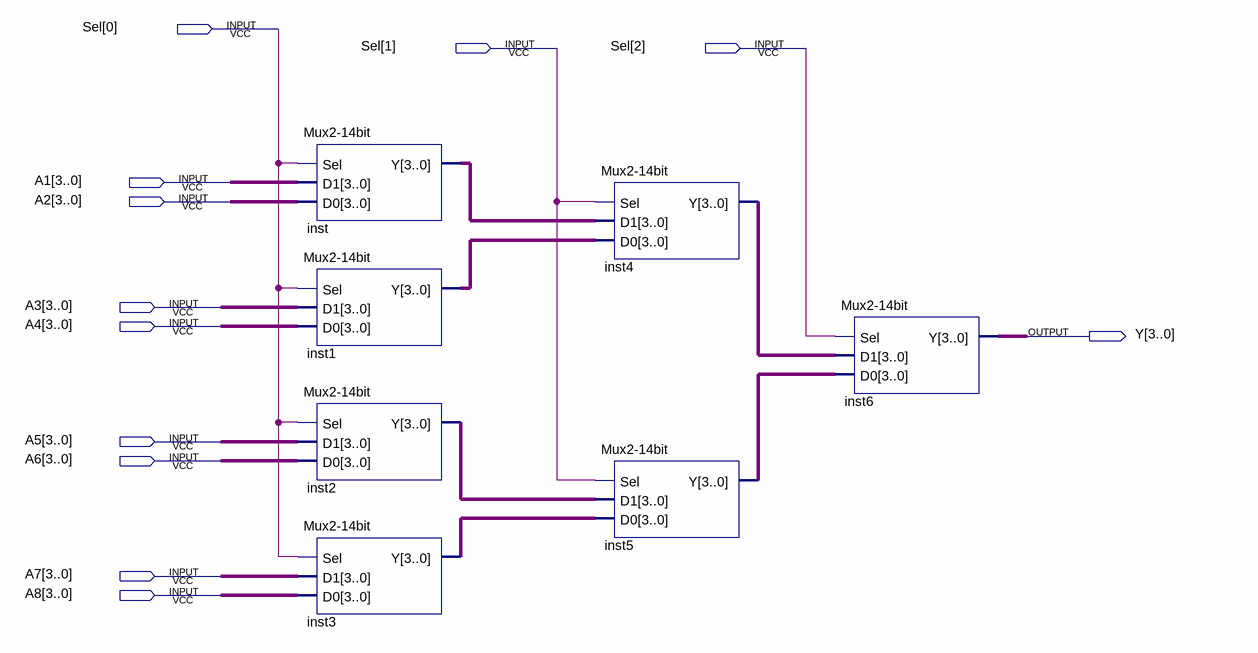
[diagram p0: schematic sheet]
// Quartus schematic Selecter.bdf as structural Verilog: 7 symbols, 12 pins
module Selecter (
  input  [2:0] Sel,
  input  [3:0] A1,
  input  [3:0] A2,
  input  [3:0] A3,
  input  [3:0] A4,
  input  [3:0] A5,
  input  [3:0] A6,
  input  [3:0] A7,
  input  [3:0] A8,
  output [3:0] Y
);

  wire [3:0] inst1_y, inst2_y, inst3_y, inst4_y, inst5_y, inst_y;

  \Mux2-14bit  inst (.Sel(Sel[0]), .D0(A2), .D1(A1), .Y(inst_y));
  \Mux2-14bit  inst1 (.Sel(Sel[0]), .D0(A4), .D1(A3), .Y(inst1_y));
  \Mux2-14bit  inst2 (.Sel(Sel[0]), .D0(A6), .D1(A5), .Y(inst2_y));
  \Mux2-14bit  inst3 (.Sel(Sel[0]), .D0(A8), .D1(A7), .Y(inst3_y));
  \Mux2-14bit  inst4 (.Sel(Sel[1]), .D0(inst1_y), .D1(inst_y), .Y(inst4_y));
  \Mux2-14bit  inst5 (.Sel(Sel[1]), .D0(inst3_y), .D1(inst2_y), .Y(inst5_y));
  \Mux2-14bit  inst6 (.Sel(Sel[2]), .D0(inst5_y), .D1(inst4_y), .Y(Y));
endmodule
